* Ex5_Ex_Multiplier_Working_Simplified.asc, continued
M86 N011 C0 0 0 NMOS l=180n w=880n
M87 N001 N004 N007 N001 PMOS l=180n w=880n
M88 N007 N004 0 0 NMOS l=180n w=440n
M89 N013 X2 N016 N013 PMOS l=180n w=880n
M90 N013 C1 N016 N013 PMOS l=180n w=880n
M91 N016 X2 N023 0 NMOS l=180n w=880n
M92 N023 C1 0 0 NMOS l=180n w=880n
M93 N013 N016 N020 N013 PMOS l=180n w=880n
M94 N020 N016 0 0 NMOS l=180n w=440n
V6 N028 0 1.8V
M95 N028 0 N040 N028 PMOS l=180n w=880n
M96 N040 0 0 0 NMOS l=180n w=440n
M97 N028 N035 N046 N028 PMOS l=180n w=880n
M98 N046 N035 0 0 NMOS l=180n w=440n
M99 N035 N040 N039 0 NMOS l=180n w=440n
M100 N039 0 N035 N028 PMOS l=180n w=440n
M101 N046 0 N039 0 NMOS l=180n w=440n
M102 N039 N040 N046 N028 PMOS l=180n w=440n
C8 N049 0 1fF
C9 N039 0 1fF
M103 N028 N040 N048 N028 PMOS l=180n w=1760n
M104 N048 N046 N049 N028 PMOS l=180n w=1760n
M105 N049 N040 0 0 NMOS l=180n w=440n
M106 N049 N046 0 0 NMOS l=180n w=440n
M107 N013 X3 N015 N013 PMOS l=180n w=880n
M108 N013 C1 N015 N013 PMOS l=180n w=880n
M109 N015 X3 N022 0 NMOS l=180n w=880n
M110 N022 C1 0 0 NMOS l=180n w=880n
M111 N013 N015 0 N013 PMOS l=180n w=880n
M112 0 N015 0 0 NMOS l=180n w=440n
V7 N066 0 1.8V
M113 N066 N057 N080 N066 PMOS l=180n w=880n
M114 N080 N057 0 0 NMOS l=180n w=440n
M115 N066 N041 N086 N066 PMOS l=180n w=880n
M116 N086 N041 0 0 NMOS l=180n w=440n
M117 N041 N080 P2 0 NMOS l=180n w=440n
M118 P2 N057 N041 N066 PMOS l=180n w=440n
M119 N086 N057 P2 0 NMOS l=180n w=440n
M120 P2 N080 N086 N066 PMOS l=180n w=440n
C10 N075 0 1fF
C11 P2 0 1fF
M121 N066 N080 N090 N066 PMOS l=180n w=1760n
M122 N090 N086 N075 N066 PMOS l=180n w=1760n
M123 N075 N080 0 0 NMOS l=180n w=440n
M124 N075 N086 0 0 NMOS l=180n w=440n
V8 N065 0 1.8V
M125 N065 N058 N079 N065 PMOS l=180n w=880n
M126 N079 N058 0 0 NMOS l=180n w=440n
M127 N065 N042 N085 N065 PMOS l=180n w=880n
M128 N085 N042 0 0 NMOS l=180n w=440n
M129 N065 N075 N091 N065 PMOS l=180n w=880n
M130 N091 N075 0 0 NMOS l=180n w=440n
M131 N042 N079 N072 0 NMOS l=180n w=440n
M132 N072 N058 N042 N065 PMOS l=180n w=440n
M133 N085 N058 N072 0 NMOS l=180n w=440n
M134 N072 N079 N085 N065 PMOS l=180n w=440n
M135 N065 N072 N069 N065 PMOS l=180n w=880n
M136 N069 N072 0 0 NMOS l=180n w=440n
M137 N075 N069 N083 0 NMOS l=180n w=440n
M138 N083 N072 N075 N065 PMOS l=180n w=440n
M139 N091 N072 N083 0 NMOS l=180n w=440n
M140 N083 N069 N091 N065 PMOS l=180n w=440n
C12 N083 0 1fF
M141 N075 N072 N076 0 NMOS l=180n w=440n
M142 N076 N069 N075 N065 PMOS l=180n w=440n
M143 N042 N069 N076 0 NMOS l=180n w=440n
M144 N076 N072 N042 N065 PMOS l=180n w=440n
C13 N076 0 1fF
V9 N067 0 1.8V
M145 N067 N060 N081 N067 PMOS l=180n w=880n
M146 N081 N060 0 0 NMOS l=180n w=440n
M147 N067 N039 N088 N067 PMOS l=180n w=880n
M148 N088 N039 0 0 NMOS l=180n w=440n
M149 N067 N076 N092 N067 PMOS l=180n w=880n
M150 N092 N076 0 0 NMOS l=180n w=440n
M151 N039 N081 N073 0 NMOS l=180n w=440n
M152 N073 N060 N039 N067 PMOS l=180n w=440n
M153 N088 N060 N073 0 NMOS l=180n w=440n
M154 N073 N081 N088 N067 PMOS l=180n w=440n
M155 N067 N073 N070 N067 PMOS l=180n w=880n
M156 N070 N073 0 0 NMOS l=180n w=440n
M157 N076 N070 N084 0 NMOS l=180n w=440n
M158 N084 N073 N076 N067 PMOS l=180n w=440n
M159 N092 N073 N084 0 NMOS l=180n w=440n
M160 N084 N070 N092 N067 PMOS l=180n w=440n
C14 N084 0 1fF
M161 N076 N073 N077 0 NMOS l=180n w=440n
M162 N077 N070 N076 N067 PMOS l=180n w=440n
M163 N039 N070 N077 0 NMOS l=180n w=440n
M164 N077 N073 N039 N067 PMOS l=180n w=440n
C15 N077 0 1fF
V10 N068 0 1.8V
M165 N068 N059 N082 N068 PMOS l=180n w=880n
M166 N082 N059 0 0 NMOS l=180n w=440n
M167 N068 N049 N089 N068 PMOS l=180n w=880n
M168 N089 N049 0 0 NMOS l=180n w=440n
M169 N068 N077 N093 N068 PMOS l=180n w=880n
M170 N093 N077 0 0 NMOS l=180n w=440n
M171 N049 N082 N074 0 NMOS l=180n w=440n
M172 N074 N059 N049 N068 PMOS l=180n w=440n
M173 N089 N059 N074 0 NMOS l=180n w=440n
M174 N074 N082 N089 N068 PMOS l=180n w=440n
M175 N068 N074 N071 N068 PMOS l=180n w=880n
M176 N071 N074 0 0 NMOS l=180n w=440n
M177 N077 N071 N087 0 NMOS l=180n w=440n
M178 N087 N074 N077 N068 PMOS l=180n w=440n
M179 N093 N074 N087 0 NMOS l=180n w=440n
M180 N087 N071 N093 N068 PMOS l=180n w=440n
C16 N087 0 1fF
M181 N077 N074 N078 0 NMOS l=180n w=440n
M182 N078 N071 N077 N068 PMOS l=180n w=440n
M183 N049 N071 N078 0 NMOS l=180n w=440n
M184 N078 N074 N049 N068 PMOS l=180n w=440n
C17 N078 0 1fF
M185 N052 X0 N053 N052 PMOS l=180n w=880n
M186 N052 C2 N053 N052 PMOS l=180n w=880n
M187 N053 X0 N061 0 NMOS l=180n w=880n
M188 N061 C2 0 0 NMOS l=180n w=880n
M189 N052 N053 N057 N052 PMOS l=180n w=880n
M190 N057 N053 0 0 NMOS l=180n w=440n
V11 N052 0 1.8V
M191 N052 X1 N056 N052 PMOS l=180n w=880n
M192 N052 C2 N056 N052 PMOS l=180n w=880n
M193 N056 X1 N064 0 NMOS l=180n w=880n
M194 N064 C2 0 0 NMOS l=180n w=880n
M195 N052 N056 N058 N052 PMOS l=180n w=880n
M196 N058 N056 0 0 NMOS l=180n w=440n
M197 N052 X2 N055 N052 PMOS l=180n w=880n
M198 N052 C2 N055 N052 PMOS l=180n w=880n
M199 N055 X2 N063 0 NMOS l=180n w=880n
M200 N063 C2 0 0 NMOS l=180n w=880n
M201 N052 N055 N060 N052 PMOS l=180n w=880n
M202 N060 N055 0 0 NMOS l=180n w=440n
M203 N052 X3 N054 N052 PMOS l=180n w=880n
M204 N052 C2 N054 N052 PMOS l=180n w=880n
M205 N054 X3 N062 0 NMOS l=180n w=880n
M206 N062 C2 0 0 NMOS l=180n w=880n
M207 N052 N054 N059 N052 PMOS l=180n w=880n
M208 N059 N054 0 0 NMOS l=180n w=440n
V12 N108 0 1.8V
M209 N108 N099 N121 N108 PMOS l=180n w=880n
M210 N121 N099 0 0 NMOS l=180n w=440n
M211 N108 N083 N125 N108 PMOS l=180n w=880n
M212 N125 N083 0 0 NMOS l=180n w=440n
M213 N083 N121 P3 0 NMOS l=180n w=440n
M214 P3 N099 N083 N108 PMOS l=180n w=440n
M215 N125 N099 P3 0 NMOS l=180n w=440n
M216 P3 N121 N125 N108 PMOS l=180n w=440n
C18 N117 0 1fF
C19 P3 0 1fF
M217 N108 N121 N128 N108 PMOS l=180n w=1760n
M218 N128 N125 N117 N108 PMOS l=180n w=1760n
M219 N117 N121 0 0 NMOS l=180n w=440n
M220 N117 N125 0 0 NMOS l=180n w=440n
V13 N107 0 1.8V
M221 N107 N100 N120 N107 PMOS l=180n w=880n
M222 N120 N100 0 0 NMOS l=180n w=440n
M223 N107 N084 N124 N107 PMOS l=180n w=880n
M224 N124 N084 0 0 NMOS l=180n w=440n
M225 N107 N117 N129 N107 PMOS l=180n w=880n
M226 N129 N117 0 0 NMOS l=180n w=440n
M227 N084 N120 N114 0 NMOS l=180n w=440n
M228 N114 N100 N084 N107 PMOS l=180n w=440n
M229 N124 N100 N114 0 NMOS l=180n w=440n
M230 N114 N120 N124 N107 PMOS l=180n w=440n
M231 N107 N114 N111 N107 PMOS l=180n w=880n
M232 N111 N114 0 0 NMOS l=180n w=440n
M233 N117 N111 P4 0 NMOS l=180n w=440n
M234 P4 N114 N117 N107 PMOS l=180n w=440n
M235 N129 N114 P4 0 NMOS l=180n w=440n
M236 P4 N111 N129 N107 PMOS l=180n w=440n
C20 P4 0 1fF
M237 N117 N114 N118 0 NMOS l=180n w=440n
M238 N118 N111 N117 N107 PMOS l=180n w=440n
M239 N084 N111 N118 0 NMOS l=180n w=440n
M240 N118 N114 N084 N107 PMOS l=180n w=440n
C21 N118 0 1fF
V14 N109 0 1.8V
M241 N109 N102 N122 N109 PMOS l=180n w=880n
M242 N122 N102 0 0 NMOS l=180n w=440n
M243 N109 N087 N126 N109 PMOS l=180n w=880n
M244 N126 N087 0 0 NMOS l=180n w=440n
M245 N109 N118 N130 N109 PMOS l=180n w=880n
M246 N130 N118 0 0 NMOS l=180n w=440n
M247 N087 N122 N115 0 NMOS l=180n w=440n
M248 N115 N102 N087 N109 PMOS l=180n w=440n
M249 N126 N102 N115 0 NMOS l=180n w=440n
M250 N115 N122 N126 N109 PMOS l=180n w=440n
M251 N109 N115 N112 N109 PMOS l=180n w=880n
M252 N112 N115 0 0 NMOS l=180n w=440n
M253 N118 N112 P5 0 NMOS l=180n w=440n
M254 P5 N115 N118 N109 PMOS l=180n w=440n
M255 N130 N115 P5 0 NMOS l=180n w=440n
M256 P5 N112 N130 N109 PMOS l=180n w=440n
C22 P5 0 1fF
M257 N118 N115 N119 0 NMOS l=180n w=440n
M258 N119 N112 N118 N109 PMOS l=180n w=440n
M259 N087 N112 N119 0 NMOS l=180n w=440n
M260 N119 N115 N087 N109 PMOS l=180n w=440n
C23 N119 0 1fF
V15 N110 0 1.8V
M261 N110 N101 N123 N110 PMOS l=180n w=880n
M262 N123 N101 0 0 NMOS l=180n w=440n
M263 N110 N078 N127 N110 PMOS l=180n w=880n
M264 N127 N078 0 0 NMOS l=180n w=440n
M265 N110 N119 N131 N110 PMOS l=180n w=880n
M266 N131 N119 0 0 NMOS l=180n w=440n
M267 N078 N123 N116 0 NMOS l=180n w=440n
M268 N116 N101 N078 N110 PMOS l=180n w=440n
M269 N127 N101 N116 0 NMOS l=180n w=440n
M270 N116 N123 N127 N110 PMOS l=180n w=440n
M271 N110 N116 N113 N110 PMOS l=180n w=880n
M272 N113 N116 0 0 NMOS l=180n w=440n
M273 N119 N113 P6 0 NMOS l=180n w=440n
M274 P6 N116 N119 N110 PMOS l=180n w=440n
M275 N131 N116 P6 0 NMOS l=180n w=440n
M276 P6 N113 N131 N110 PMOS l=180n w=440n
C24 P6 0 1fF
M277 N119 N116 P7 0 NMOS l=180n w=440n
M278 P7 N113 N119 N110 PMOS l=180n w=440n
M279 N078 N113 P7 0 NMOS l=180n w=440n
M280 P7 N116 N078 N110 PMOS l=180n w=440n
C25 P7 0 1fF
M281 N094 X0 N095 N094 PMOS l=180n w=880n
M282 N094 C3 N095 N094 PMOS l=180n w=880n
M283 N095 X0 N103 0 NMOS l=180n w=880n
M284 N103 C3 0 0 NMOS l=180n w=880n
M285 N094 N095 N099 N094 PMOS l=180n w=880n
M286 N099 N095 0 0 NMOS l=180n w=440n
V16 N094 0 1.8V
M287 N094 X1 N098 N094 PMOS l=180n w=880n
M288 N094 C3 N098 N094 PMOS l=180n w=880n
M289 N098 X1 N106 0 NMOS l=180n w=880n
M290 N106 C3 0 0 NMOS l=180n w=880n
M291 N094 N098 N100 N094 PMOS l=180n w=880n
M292 N100 N098 0 0 NMOS l=180n w=440n
M293 N094 X2 N097 N094 PMOS l=180n w=880n
M294 N094 C3 N097 N094 PMOS l=180n w=880n
M295 N097 X2 N105 0 NMOS l=180n w=880n
M296 N105 C3 0 0 NMOS l=180n w=880n
M297 N094 N097 N102 N094 PMOS l=180n w=880n
M298 N102 N097 0 0 NMOS l=180n w=440n
M299 N094 X3 N096 N094 PMOS l=180n w=880n
M300 N094 C3 N096 N094 PMOS l=180n w=880n
M301 N096 X3 N104 0 NMOS l=180n w=880n
M302 N104 C3 0 0 NMOS l=180n w=880n
M303 N094 N096 N101 N094 PMOS l=180n w=880n
M304 N101 N096 0 0 NMOS l=180n w=440n
* -A
* -B
* A
* B
* C
* B
* -A
* A
* -B
* A
* P1
* XOR(AB)
* C_out
* -A
* -A
* -B
* -B
* P0
* A0
* B0
* A1
* A0
* B0
* A1
* B0
* A0
* B1
* B1
* -A
* -B
* -C
* A
* B
* C
* B
* -A
* A
* -B
* A
* A[xor]B
* -(A[xor]B)
* -(A[xor]B)
* A[xor]B
* A[xor]B
* C
* S0
* C
* -(A[xor]B)
* -(A[xor]B)
* A[xor]B
* B
* C_out
* XOR(AB)
* A2
* B0
* A1
* B1
* A2
* -A
* -B
* -C
* A
* B
* C
* B
* -A
* A
* -B
* A
* A[xor]B
* -(A[xor]B)
* -(A[xor]B)
* A[xor]B
* A[xor]B
* C
* S0
* C
* -(A[xor]B)
* -(A[xor]B)
* A[xor]B
* B
* C_out
* XOR(AB)
* A3
* B0
* A2
* B1
* A3
* -A
* -B
* A
* B
* C
* B
* -A
* A
* -B
* A
* S
* XOR(AB)
* C_out
* -A
* -A
* -B
* -B
* A3
* B1
* -A
* -B
* A
* B
* C
* B
* -A
* A
* -B
* A
* P2
* XOR(AB)
* C_out
* -A
* -A
* -B
* -B
* -A
* -B
* -C
* A
* B
* C
* B
* -A
* A
* -B
* A
* A[xor]B
* -(A[xor]B)
* -(A[xor]B)
* A[xor]B
* A[xor]B
* C
* S0
* C
* -(A[xor]B)
* -(A[xor]B)
* A[xor]B
* B
* C_out
* XOR(AB)
* -A
* -B
* -C
* A
* B
* C
* B
* -A
* A
* -B
* A
* A[xor]B
* -(A[xor]B)
* -(A[xor]B)
* A[xor]B
* A[xor]B
* C
* S0
* C
* -(A[xor]B)
* -(A[xor]B)
* A[xor]B
* B
* C_out
* XOR(AB)
* -A
* -B
* -C
* A
* B
* C
* B
* -A
* A
* -B
* A
* A[xor]B
* -(A[xor]B)
* -(A[xor]B)
* A[xor]B
* A[xor]B
* C
* S0
* C
* -(A[xor]B)
* -(A[xor]B)
* A[xor]B
* B
* C_out
* XOR(AB)
* A0
* B2
* A1
* B2
* A2
* B2
* A3
* B2
* B2
* S0
* S0
* S
* -A
* -B
* A
* B
* C
* B
* -A
* A
* -B
* A
* P3
* XOR(AB)
* C_out
* -A
* -A
* -B
* -B
* -A
* -B
* -C
* A
* B
* C
* B
* -A
* A
* -B
* A
* A[xor]B
* -(A[xor]B)
* -(A[xor]B)
* A[xor]B
* A[xor]B
* C
* P4
* C
* -(A[xor]B)
* -(A[xor]B)
* A[xor]B
* B
* C_out
* XOR(AB)
* -A
* -B
* -C
* A
* B
* C
* B
* -A
* A
* -B
* A
* A[xor]B
* -(A[xor]B)
* -(A[xor]B)
* A[xor]B
* A[xor]B
* C
* P5
* C
* -(A[xor]B)
* -(A[xor]B)
* A[xor]B
* B
* C_out
* XOR(AB)
* -A
* -B
* -C
* A
* B
* C
* B
* -A
* A
* -B
* A
* A[xor]B
* -(A[xor]B)
* -(A[xor]B)
* A[xor]B
* A[xor]B
* C
* P6
* C
* -(A[xor]B)
* -(A[xor]B)
* A[xor]B
* B
* P7
* XOR(AB)
* A0
* B3
* A1
* A2
* A3
* S0
* S0
* S
* B3
* B3
* B3
* B3
* LOT: n94s                  WAF: 08
* Temperature_parameters=Default
.MODEL nmos nmos LEVEL = 8
+VERSION = 3.1            TNOM    = 27             TOX     = 5.8E-9
+XJ      = 1E-7           NCH     = 2.3549E17      VTH0    = 0.4308936
+K1      = 0.3519429      K2      = 0.0298493      K3      = 1E-3
+K3B     = 0.0592323      W0      = 1E-5           NLX     = 1.465901E-7
+DVT0W   = 0              DVT1W   = 0              DVT2W   = 0
+DVT0    = 0.0183405      DVT1    = 4.897584E-3    DVT2    = -0.0252658
+U0      = 455.3033362    UA      = 5.223592E-10   UB      = 1.104713E-18
+UC      = 3.287888E-11   VSAT    = 1.050993E5     A0      = 1.2318623
+AGS     = 0.3043334      B0      = 6.67749E-8     B1      = 5E-6
+KETA    = 8.518046E-4    A1      = 0              A2      = 1
+RDSW    = 509.5675851    PRWG    = 0.0227558      PRWB    = -1E-3
+WR      = 1              WINT    = 2.126497E-9    LINT    = 4.393474E-9
+XL      = -3E-8          XW      = 0              DWG     = -3.409033E-9
+DWB     = 2.794842E-9    VOFF    = -0.1026054     NFACTOR = 0.1344887
+CIT     = 0              CDSC    = 1.527511E-3    CDSCD   = 0
+CDSCB   = 0              ETA0    = 3.48737E-3     ETAB    = 4.557986E-4
+DSUB    = 3.045473E-3    PCLM    = 1.0446257      PDIBLC1 = 0.1441952
+PDIBLC2 = 4.513382E-4    PDIBLCB = -2.816756E-5   DROUT   = 0.4698725
+PSCBE1  = 1.761109E10    PSCBE2  = 3.772916E-9    PVAG    = 0.0361824
+DELTA   = 0.01           MOBMOD  = 1              PRT     = 0
+UTE     = -1.5           KT1     = -0.11          KT1L    = 0
+KT2     = 0.022          UA1     = 4.31E-9        UB1     = -7.61E-18
+UC1     = -5.6E-11       AT      = 3.3E4          WL      = 0
+WLN     = 1              WW      = 0              WWN     = 1
+WWL     = 0              LL      = 0              LLN     = 1
+LW      = 0              LWN     = 1              LWL     = 0
+CAPMOD  = 2              XPART   = 0.4            CGDO    = 6.27E-10
+CGSO    = 6.27E-10       CGBO    = 0              CJ      = 1.918655E-3
+PB      = 0.9784049      MJ      = 0.4721729      CJSW    = 4.441595E-10
+PBSW    = 0.9419636      MJSW    = 0.2871118      PVTH0   = 1.342985E-3
+PRDSW   = -61.8357222    PK2     = -3.140724E-3   WKETA   = 7.512693E-4
+LKETA   = -6.144062E-3
* LOT: n94s                  WAF: 08
* Temperature_parameters=Default
.MODEL pmos pmos LEVEL = 8
+VERSION = 3.1            TNOM    = 27             TOX     = 5.8E-9
+XJ      = 1E-7           NCH     = 4.1589E17      VTH0    = -0.6158735
+K1      = 0.4598379      K2      = 0.0399415      K3      = 0
+K3B     = 8.7410723      W0      = 1E-6           NLX     = 1E-9
+DVT0W   = 0              DVT1W   = 0              DVT2W   = 0
+DVT0    = 0.6249485      DVT1    = 0.203296       DVT2    = -0.0513763
+U0      = 158.67524      UA      = 2.200024E-10   UB      = 4.457415E-18
+UC      = 1.02138E-10    VSAT    = 1.85064E5      A0      = 1.3826397
+AGS     = 0.4192977      B0      = 2.844099E-6    B1      = 5E-6
+KETA    = 0.0208695      A1      = 0              A2      = 1
+RDSW    = 968.5463       PRWG    = -0.1026483     PRWB    = -0.325
+WR      = 1              WINT    = 2.748811E-8    LINT    = 8.71907E-9
+XL      = -3E-8          XW      = 0              DWG     = -4.087585E-8
+DWB     = 2.032008E-8    VOFF    = -0.15          NFACTOR = 1.5460516
+CIT     = 0              CDSC    = 1.413317E-4    CDSCD   = 0
+CDSCB   = 0              ETA0    = 0.3241245      ETAB    = -0.1842
+DSUB    = 1.0287138      PCLM    = 5.2654567      PDIBLC1 = 4.228338E-3
+PDIBLC2 = 1.204519E-3    PDIBLCB = 2.37525E-3     DROUT   = 0
+PSCBE1  = 3.011456E10    PSCBE2  = 3.037042E-7    PVAG    = 8.9564294
+DELTA   = 0.01           MOBMOD  = 1              PRT     = 0
+UTE     = -1.5           KT1     = -0.11          KT1L    = 0
+KT2     = 0.022          UA1     = 4.31E-9        UB1     = -7.61E-18
+UC1     = -5.6E-11       AT      = 3.3E4          WL      = 0
+WLN     = 1              WW      = 0              WWN     = 1
+WWL     = 0              LL      = 0              LLN     = 1
+LW      = 0              LWN     = 1              LWL     = 0
+CAPMOD  = 2              XPART   = 0.4            CGDO    = 5.59E-10
+CGSO    = 5.59E-10       CGBO    = 0              CJ      = 1.882857E-3
+PB      = 0.9891317      MJ      = 0.4679789      CJSW    = 3.67186E-10
+PBSW    = 0.9884654      MJSW    = 0.3562128      PVTH0   = 3.923756E-3
+PRDSW   = 15.3953053     PK2     = 2.061759E-3    WKETA   = 4.10049E-3
+LKETA   = -0.0232426     LVSAT   = 1.257E5
.ends multiplier

.subckt 8-bit_memory Clk Clk_bar w0 w1 w2 w3 w4 w5 w6 w7 Y0 Y1 Y2 Y3 Y4 Y5 Y6 Y7
M1 N006 Clk N011 N002 PMOS l=180n w=6000n
M2 N011 Clk_bar N006 0 NMOS l=180n w=6000n
M3 N002 N006 Y0 N002 PMOS l=180n w=3520n
M4 Y0 N006 0 0 NMOS l=180n w=1760n
M5 N006 Y0 N002 N002 PMOS l=180n w=880n
M6 0 Y0 N006 0 NMOS l=180n w=440n
V1 N002 0 1.8V
C1 N006 0 1fF
C2 Y0 0 1fF
M7 N021 Clk N024 N017 PMOS l=180n w=6000n
M8 N024 Clk_bar N021 0 NMOS l=180n w=6000n
M9 N017 N021 Y2 N017 PMOS l=180n w=3520n
M10 Y2 N021 0 0 NMOS l=180n w=1760n
M11 N021 Y2 N017 N017 PMOS l=180n w=880n
M12 0 Y2 N021 0 NMOS l=180n w=440n
V2 N017 0 1.8V
C3 N021 0 1fF
C4 Y2 0 1fF
M13 N005 Clk N009 N001 PMOS l=180n w=6000n
M14 N009 Clk_bar N005 0 NMOS l=180n w=6000n
M15 N001 N005 Y1 N001 PMOS l=180n w=3520n
M16 Y1 N005 0 0 NMOS l=180n w=1760n
M17 N005 Y1 N001 N001 PMOS l=180n w=880n
M18 0 Y1 N005 0 NMOS l=180n w=440n
V3 N001 0 1.8V
C5 N005 0 1fF
C6 Y1 0 1fF
M19 N020 Clk N025 N016 PMOS l=180n w=6000n
M20 N025 Clk_bar N020 0 NMOS l=180n w=6000n
M21 N016 N020 Y3 N016 PMOS l=180n w=3520n
M22 Y3 N020 0 0 NMOS l=180n w=1760n
M23 N020 Y3 N016 N016 PMOS l=180n w=880n
M24 0 Y3 N020 0 NMOS l=180n w=440n
V4 N016 0 1.8V
C7 N020 0 1fF
C8 Y3 0 1fF
V5 N010 0 1.8V
M27 N010 w2 N024 N010 PMOS l=180n w=4000n
M28 N024 w2 0 0 NMOS l=180n w=2000n
M29 N010 w0 N011 N010 PMOS l=180n w=4000n
M30 N011 w0 0 0 NMOS l=180n w=2000n
M31 N025 w3 0 0 NMOS l=180n w=2000n
M32 N010 w3 N025 N010 PMOS l=180n w=4000n
M33 N010 w1 N009 N010 PMOS l=180n w=4000n
M34 N009 w1 0 0 NMOS l=180n w=2000n
M35 N008 Clk N014 N004 PMOS l=180n w=6000n
M36 N014 N015 N008 0 NMOS l=180n w=6000n
M37 N004 N008 Y4 N004 PMOS l=180n w=3520n
M38 Y4 N008 0 0 NMOS l=180n w=1760n
M39 N008 Y4 N004 N004 PMOS l=180n w=880n
M40 0 Y4 N008 0 NMOS l=180n w=440n
V6 N004 0 1.8V
C9 N008 0 1fF
C10 Y4 0 1fF
M41 N023 Clk N026 N019 PMOS l=180n w=6000n
M42 N026 N015 N023 0 NMOS l=180n w=6000n
M43 N019 N023 Y6 N019 PMOS l=180n w=3520n
M44 Y6 N023 0 0 NMOS l=180n w=1760n
M45 N023 Y6 N019 N019 PMOS l=180n w=880n
M46 0 Y6 N023 0 NMOS l=180n w=440n
V7 N019 0 1.8V
C11 N023 0 1fF
C12 Y6 0 1fF
M47 N007 Clk N012 N003 PMOS l=180n w=6000n
M48 N012 N015 N007 0 NMOS l=180n w=6000n
M49 N003 N007 Y5 N003 PMOS l=180n w=3520n
M50 Y5 N007 0 0 NMOS l=180n w=1760n
M51 N007 Y5 N003 N003 PMOS l=180n w=880n
M52 0 Y5 N007 0 NMOS l=180n w=440n
V8 N003 0 1.8V
C13 N007 0 1fF
C14 Y5 0 1fF
M53 N022 Clk N027 N018 PMOS l=180n w=6000n
M54 N027 N015 N022 0 NMOS l=180n w=6000n
M55 N018 N022 Y7 N018 PMOS l=180n w=3520n
M56 Y7 N022 0 0 NMOS l=180n w=1760n
M57 N022 Y7 N018 N018 PMOS l=180n w=880n
M58 0 Y7 N022 0 NMOS l=180n w=440n
V9 N018 0 1.8V
C15 N022 0 1fF
C16 Y7 0 1fF
V10 N013 0 1.8V
M59 N013 Clk N015 N013 PMOS l=180n w=8800n
M60 N015 Clk 0 0 NMOS l=180n w=4400n
M61 N013 w6 N026 N013 PMOS l=180n w=4000n
M62 N026 w6 0 0 NMOS l=180n w=2000n
M63 N013 w4 N014 N013 PMOS l=180n w=4000n
M64 N014 w4 0 0 NMOS l=180n w=2000n
M65 N027 w7 0 0 NMOS l=180n w=2000n
M66 N013 w7 N027 N013 PMOS l=180n w=4000n
M67 N013 w5 N012 N013 PMOS l=180n w=4000n
M68 N012 w5 0 0 NMOS l=180n w=2000n
* CLK
* CLK_bar
* D_bar
* D
* D
* Q
* D
* CLK
* CLK_bar
* D_bar
* D
* D
* Q
* D
* CLK
* CLK_bar
* D_bar
* D
* D
* Q
* D
* CLK
* CLK_bar
* D_bar
* D
* D
* Q
* D
* CLK
* CLK_bar
* w1
* w2
* w3
* -w0
* -w1
* -w2
* -w3
* CLK
* CLK_bar
* D_bar
* D
* D
* Q
* D
* CLK
* CLK_bar
* D_bar
* D
* D
* Q
* D
* CLK
* CLK_bar
* D_bar
* D
* D
* Q
* D
* CLK
* CLK_bar
* D_bar
* D
* D
* Q
* D
* CLK
* CLK_bar
* w1
* w2
* w3
* -w0
* -w1
* -w2
* -w3
* Y0
* Y1
* Y2
* Y3
* Y4
* Y5
* Y6
* Y7
* w0
* w0
* LOT: n94s                  WAF: 08
* Temperature_parameters=Default
.MODEL nmos nmos LEVEL = 8
+VERSION = 3.1            TNOM    = 27             TOX     = 5.8E-9
+XJ      = 1E-7           NCH     = 2.3549E17      VTH0    = 0.4308936
+K1      = 0.3519429      K2      = 0.0298493      K3      = 1E-3
+K3B     = 0.0592323      W0      = 1E-5           NLX     = 1.465901E-7
+DVT0W   = 0              DVT1W   = 0              DVT2W   = 0
+DVT0    = 0.0183405      DVT1    = 4.897584E-3    DVT2    = -0.0252658
+U0      = 455.3033362    UA      = 5.223592E-10   UB      = 1.104713E-18
+UC      = 3.287888E-11   VSAT    = 1.050993E5     A0      = 1.2318623
+AGS     = 0.3043334      B0      = 6.67749E-8     B1      = 5E-6
+KETA    = 8.518046E-4    A1      = 0              A2      = 1
+RDSW    = 509.5675851    PRWG    = 0.0227558      PRWB    = -1E-3
+WR      = 1              WINT    = 2.126497E-9    LINT    = 4.393474E-9
+XL      = -3E-8          XW      = 0              DWG     = -3.409033E-9
+DWB     = 2.794842E-9    VOFF    = -0.1026054     NFACTOR = 0.1344887
+CIT     = 0              CDSC    = 1.527511E-3    CDSCD   = 0
+CDSCB   = 0              ETA0    = 3.48737E-3     ETAB    = 4.557986E-4
+DSUB    = 3.045473E-3    PCLM    = 1.0446257      PDIBLC1 = 0.1441952
+PDIBLC2 = 4.513382E-4    PDIBLCB = -2.816756E-5   DROUT   = 0.4698725
+PSCBE1  = 1.761109E10    PSCBE2  = 3.772916E-9    PVAG    = 0.0361824
+DELTA   = 0.01           MOBMOD  = 1              PRT     = 0
+UTE     = -1.5           KT1     = -0.11          KT1L    = 0
+KT2     = 0.022          UA1     = 4.31E-9        UB1     = -7.61E-18
+UC1     = -5.6E-11       AT      = 3.3E4          WL      = 0
+WLN     = 1              WW      = 0              WWN     = 1
+WWL     = 0              LL      = 0              LLN     = 1
+LW      = 0              LWN     = 1              LWL     = 0
+CAPMOD  = 2              XPART   = 0.4            CGDO    = 6.27E-10
+CGSO    = 6.27E-10       CGBO    = 0              CJ      = 1.918655E-3
+PB      = 0.9784049      MJ      = 0.4721729      CJSW    = 4.441595E-10
+PBSW    = 0.9419636      MJSW    = 0.2871118      PVTH0   = 1.342985E-3
+PRDSW   = -61.8357222    PK2     = -3.140724E-3   WKETA   = 7.512693E-4
+LKETA   = -6.144062E-3
* LOT: n94s                  WAF: 08
* Temperature_parameters=Default
.MODEL pmos pmos LEVEL = 8
+VERSION = 3.1            TNOM    = 27             TOX     = 5.8E-9
+XJ      = 1E-7           NCH     = 4.1589E17      VTH0    = -0.6158735
+K1      = 0.4598379      K2      = 0.0399415      K3      = 0
+K3B     = 8.7410723      W0      = 1E-6           NLX     = 1E-9
+DVT0W   = 0              DVT1W   = 0              DVT2W   = 0
+DVT0    = 0.6249485      DVT1    = 0.203296       DVT2    = -0.0513763
+U0      = 158.67524      UA      = 2.200024E-10   UB      = 4.457415E-18
+UC      = 1.02138E-10    VSAT    = 1.85064E5      A0      = 1.3826397
+AGS     = 0.4192977      B0      = 2.844099E-6    B1      = 5E-6
+KETA    = 0.0208695      A1      = 0              A2      = 1
+RDSW    = 968.5463       PRWG    = -0.1026483     PRWB    = -0.325
+WR      = 1              WINT    = 2.748811E-8    LINT    = 8.71907E-9
+XL      = -3E-8          XW      = 0              DWG     = -4.087585E-8
+DWB     = 2.032008E-8    VOFF    = -0.15          NFACTOR = 1.5460516
+CIT     = 0              CDSC    = 1.413317E-4    CDSCD   = 0
+CDSCB   = 0              ETA0    = 0.3241245      ETAB    = -0.1842
+DSUB    = 1.0287138      PCLM    = 5.2654567      PDIBLC1 = 4.228338E-3
+PDIBLC2 = 1.204519E-3    PDIBLCB = 2.37525E-3     DROUT   = 0
+PSCBE1  = 3.011456E10    PSCBE2  = 3.037042E-7    PVAG    = 8.9564294
+DELTA   = 0.01           MOBMOD  = 1              PRT     = 0
+UTE     = -1.5           KT1     = -0.11          KT1L    = 0
+KT2     = 0.022          UA1     = 4.31E-9        UB1     = -7.61E-18
+UC1     = -5.6E-11       AT      = 3.3E4          WL      = 0
+WLN     = 1              WW      = 0              WWN     = 1
+WWL     = 0              LL      = 0              LLN     = 1
+LW      = 0              LWN     = 1              LWL     = 0
+CAPMOD  = 2              XPART   = 0.4            CGDO    = 5.59E-10
+CGSO    = 5.59E-10       CGBO    = 0              CJ      = 1.882857E-3
+PB      = 0.9891317      MJ      = 0.4679789      CJSW    = 3.67186E-10
+PBSW    = 0.9884654      MJSW    = 0.3562128      PVTH0   = 3.923756E-3
+PRDSW   = 15.3953053     PK2     = 2.061759E-3    WKETA   = 4.10049E-3
+LKETA   = -0.0232426     LVSAT   = 1.257E5
.ends 8-bit_memory

.model NMOS NMOS
.model PMOS PMOS
.lib standard.mos
* LOT: n94s                  WAF: 08
* Temperature_parameters=Default
.MODEL nmos nmos LEVEL = 8
+VERSION = 3.1            TNOM    = 27             TOX     = 5.8E-9
+XJ      = 1E-7           NCH     = 2.3549E17      VTH0    = 0.4308936
+K1      = 0.3519429      K2      = 0.0298493      K3      = 1E-3
+K3B     = 0.0592323      W0      = 1E-5           NLX     = 1.465901E-7
+DVT0W   = 0              DVT1W   = 0              DVT2W   = 0
+DVT0    = 0.0183405      DVT1    = 4.897584E-3    DVT2    = -0.0252658
+U0      = 455.3033362    UA      = 5.223592E-10   UB      = 1.104713E-18
+UC      = 3.287888E-11   VSAT    = 1.050993E5     A0      = 1.2318623
+AGS     = 0.3043334      B0      = 6.67749E-8     B1      = 5E-6
+KETA    = 8.518046E-4    A1      = 0              A2      = 1
+RDSW    = 509.5675851    PRWG    = 0.0227558      PRWB    = -1E-3
+WR      = 1              WINT    = 2.126497E-9    LINT    = 4.393474E-9
+XL      = -3E-8          XW      = 0              DWG     = -3.409033E-9
+DWB     = 2.794842E-9    VOFF    = -0.1026054     NFACTOR = 0.1344887
+CIT     = 0              CDSC    = 1.527511E-3    CDSCD   = 0
+CDSCB   = 0              ETA0    = 3.48737E-3     ETAB    = 4.557986E-4
+DSUB    = 3.045473E-3    PCLM    = 1.0446257      PDIBLC1 = 0.1441952
+PDIBLC2 = 4.513382E-4    PDIBLCB = -2.816756E-5   DROUT   = 0.4698725
+PSCBE1  = 1.761109E10    PSCBE2  = 3.772916E-9    PVAG    = 0.0361824
+DELTA   = 0.01           MOBMOD  = 1              PRT     = 0
+UTE     = -1.5           KT1     = -0.11          KT1L    = 0
+KT2     = 0.022          UA1     = 4.31E-9        UB1     = -7.61E-18
+UC1     = -5.6E-11       AT      = 3.3E4          WL      = 0
+WLN     = 1              WW      = 0              WWN     = 1
+WWL     = 0              LL      = 0              LLN     = 1
+LW      = 0              LWN     = 1              LWL     = 0
+CAPMOD  = 2              XPART   = 0.4            CGDO    = 6.27E-10
+CGSO    = 6.27E-10       CGBO    = 0              CJ      = 1.918655E-3
+PB      = 0.9784049      MJ      = 0.4721729      CJSW    = 4.441595E-10
+PBSW    = 0.9419636      MJSW    = 0.2871118      PVTH0   = 1.342985E-3
+PRDSW   = -61.8357222    PK2     = -3.140724E-3   WKETA   = 7.512693E-4
+LKETA   = -6.144062E-3
* LOT: n94s                  WAF: 08
* Temperature_parameters=Default
.MODEL pmos pmos LEVEL = 8
+VERSION = 3.1            TNOM    = 27             TOX     = 5.8E-9
+XJ      = 1E-7           NCH     = 4.1589E17      VTH0    = -0.6158735
+K1      = 0.4598379      K2      = 0.0399415      K3      = 0
+K3B     = 8.7410723      W0      = 1E-6           NLX     = 1E-9
+DVT0W   = 0              DVT1W   = 0              DVT2W   = 0
+DVT0    = 0.6249485      DVT1    = 0.203296       DVT2    = -0.0513763
+U0      = 158.67524      UA      = 2.200024E-10   UB      = 4.457415E-18
+UC      = 1.02138E-10    VSAT    = 1.85064E5      A0      = 1.3826397
+AGS     = 0.4192977      B0      = 2.844099E-6    B1      = 5E-6
+KETA    = 0.0208695      A1      = 0              A2      = 1
+RDSW    = 968.5463       PRWG    = -0.1026483     PRWB    = -0.325
+WR      = 1              WINT    = 2.748811E-8    LINT    = 8.71907E-9
+XL      = -3E-8          XW      = 0              DWG     = -4.087585E-8
+DWB     = 2.032008E-8    VOFF    = -0.15          NFACTOR = 1.5460516
+CIT     = 0              CDSC    = 1.413317E-4    CDSCD   = 0
+CDSCB   = 0              ETA0    = 0.3241245      ETAB    = -0.1842
+DSUB    = 1.0287138      PCLM    = 5.2654567      PDIBLC1 = 4.228338E-3
+PDIBLC2 = 1.204519E-3    PDIBLCB = 2.37525E-3     DROUT   = 0
+PSCBE1  = 3.011456E10    PSCBE2  = 3.037042E-7    PVAG    = 8.9564294
+DELTA   = 0.01           MOBMOD  = 1              PRT     = 0
+UTE     = -1.5           KT1     = -0.11          KT1L    = 0
+KT2     = 0.022          UA1     = 4.31E-9        UB1     = -7.61E-18
+UC1     = -5.6E-11       AT      = 3.3E4          WL      = 0
+WLN     = 1              WW      = 0              WWN     = 1
+WWL     = 0              LL      = 0              LLN     = 1
+LW      = 0              LWN     = 1              LWL     = 0
+CAPMOD  = 2              XPART   = 0.4            CGDO    = 5.59E-10
+CGSO    = 5.59E-10       CGBO    = 0              CJ      = 1.882857E-3
+PB      = 0.9891317      MJ      = 0.4679789      CJSW    = 3.67186E-10
+PBSW    = 0.9884654      MJSW    = 0.3562128      PVTH0   = 3.923756E-3
+PRDSW   = 15.3953053     PK2     = 2.061759E-3    WKETA   = 4.10049E-3
+LKETA   = -0.0232426     LVSAT   = 1.257E5
.tran 6n
* I0
* I1
* I0
* I1
* Address
* Command
* CLK
* CLK_bar
* Load
* Address A
* A3
* A2
* A1
* A0
* CLK
* CLK_bar
* Load
* Address B
* B0
* B1
* B2
* B3
* CLK
* CLK_bar
* Load
* Address C
* C0
* C1
* C2
* C3
* Command decoder
* Address decoder
* Memory A
* Memory B
* Memory C
* Logic Circuit Add-Sub
* Add-Subtractor
* CLK_bar
* Clk
* Memory X
* Logic Circuit Multiply
* Multiplier
* CLK
* CLK_bar
* Multiplier
.backanno
.end

* Results of the author's LTspice run, read from the files saved beside the schematic
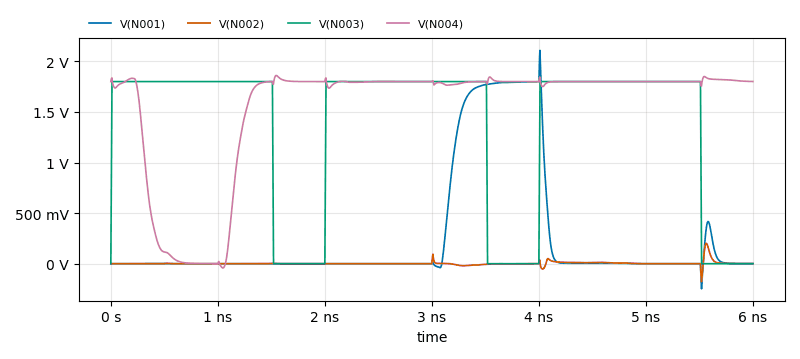
[diagram p20: Transient Analysis of Ex5_Ex_Multiplier_Working_Simplified.asc, plotted from the saved traces]
* Transient Analysis, 1 run:
*   V(N001): min -248.3 mV, max 2.109 V, average 263.4 mV, rms 656.8 mV, last 540.6 µV
*   V(N002): min -178.1 mV, max 201.4 mV, average 2.505 mV, rms 19.94 mV, last 70.31 µV
*   V(N003): min 0 V, max 1.8 V, average 1.359 V, rms 1.562 V, last 0 V
*   V(N004): min -42.66 mV, max 1.86 V, average 1.55 V, rms 1.656 V, last 1.801 V